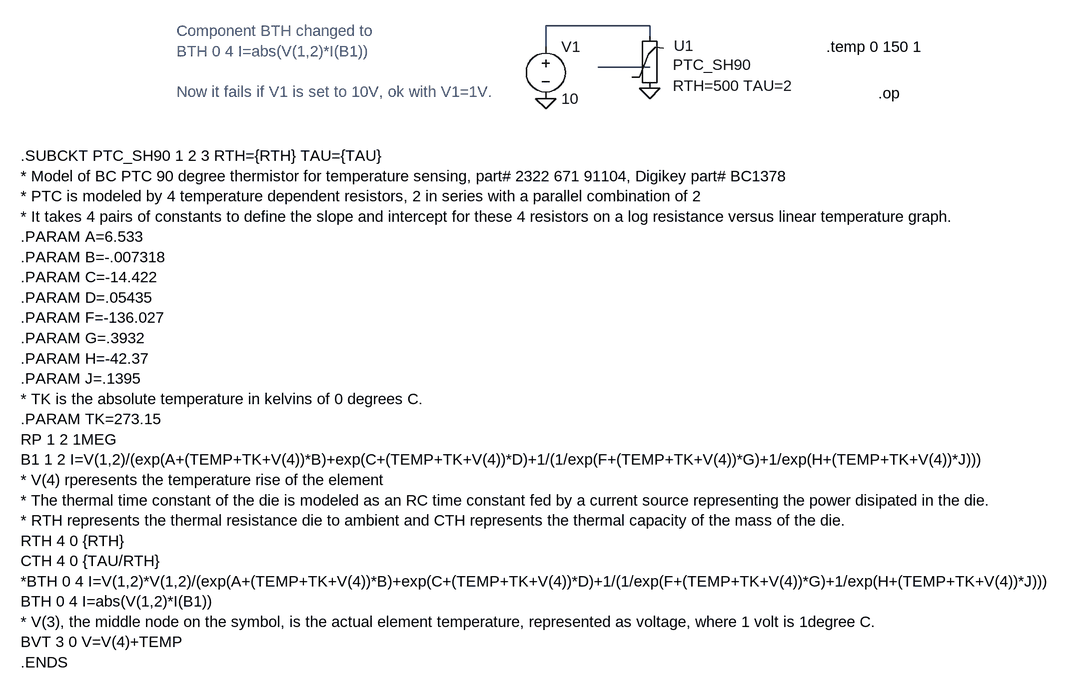
[diagram p0: schematic ptc90_2.asc]
ptc90_2.asc, the LTspice schematic file:
Version 4
SHEET 1 1628 964
WIRE 624 80 624 48
WIRE 784 48 624 48
WIRE 784 64 784 48
WIRE 784 112 704 112
FLAG 784 144 0
FLAG 624 160 0
SYMBOL voltage 624 64 R0
WINDOW 123 0 0 Left 0
WINDOW 39 0 0 Left 0
SYMATTR InstName V1
SYMATTR Value 10
SYMBOL PTC_resistor 768 48 R0
SYMATTR InstName U1
SYMATTR SpiceModel PTC_SH90
TEXT -184 248 Left 0 !.SUBCKT PTC_SH90 1 2 3 RTH={RTH} TAU={TAU}\n* Model of BC PTC 90 degree thermistor for temperature sensing, part# 2322 671 91104, Digikey part# BC1378\n* PTC is modeled by 4 temperature dependent resistors, 2 in series with a parallel combination of 2\n* It takes 4 pairs of constants to define the slope and intercept for these 4 resistors on a log resistance versus linear temperature graph.\n.PARAM A=6.533\n.PARAM B=-.007318\n.PARAM C=-14.422\n.PARAM D=.05435\n.PARAM F=-136.027\n.PARAM G=.3932\n.PARAM H=-42.37\n.PARAM J=.1395\n* TK is the absolute temperature in kelvins of 0 degrees C.\n.PARAM TK=273.15\nRP 1 2 1MEG\nB1 1 2 I=V(1,2)/(exp(A+(TEMP+TK+V(4))*B)+exp(C+(TEMP+TK+V(4))*D)+1/(1/exp(F+(TEMP+TK+V(4))*G)+1/exp(H+(TEMP+TK+V(4))*J)))\n* V(4) rperesents the temperature rise of the element\n* The thermal time constant of the die is modeled as an RC time constant fed by a current source representing the power disipated in the die.\n* RTH represents the thermal resistance die to ambient and CTH represents the thermal capacity of the mass of the die.\nRTH 4 0 {RTH}\nCTH 4 0 {TAU/RTH}\n*BTH 0 4 I=V(1,2)*V(1,2)/(exp(A+(TEMP+TK+V(4))*B)+exp(C+(TEMP+TK+V(4))*D)+1/(1/exp(F+(TEMP+TK+V(4))*G)+1/exp(H+(TEMP+TK+V(4))*J)))\nBTH 0 4 I=abs(V(1,2)*I(B1))\n* V(3), the middle node on the symbol, is the actual element temperature, represented as voltage, where 1 volt is 1degree C.\nBVT 3 0 V=V(4)+TEMP\n.ENDS
TEXT 1136 152 Left 0 !.op
TEXT 1056 80 Left 0 !.temp 0 150 1
TEXT 56 56 Left 0 ;Component BTH changed to \nBTH 0 4 I=abs(V(1,2)*I(B1))\n \nNow it fails if V1 is set to 10V, ok with V1=1V.

The netlist it stands for:
* ptc90_2.asc
V1 N001 0 10
XU1 N001 0 N002 PTC_SH90 RTH=500 TAU=2  ; pins A B A1
.SUBCKT PTC_SH90 1 2 3 RTH={RTH} TAU={TAU}
* Model of BC PTC 90 degree thermistor for temperature sensing, part# 2322 671 91104, Digikey part# BC1378
* PTC is modeled by 4 temperature dependent resistors, 2 in series with a parallel combination of 2
* It takes 4 pairs of constants to define the slope and intercept for these 4 resistors on a log resistance versus linear temperature graph.
.PARAM A=6.533
.PARAM B=-.007318
.PARAM C=-14.422
.PARAM D=.05435
.PARAM F=-136.027
.PARAM G=.3932
.PARAM H=-42.37
.PARAM J=.1395
* TK is the absolute temperature in kelvins of 0 degrees C.
.PARAM TK=273.15
RP 1 2 1MEG
B1 1 2 I=V(1,2)/(exp(A+(TEMP+TK+V(4))*B)+exp(C+(TEMP+TK+V(4))*D)+1/(1/exp(F+(TEMP+TK+V(4))*G)+1/exp(H+(TEMP+TK+V(4))*J)))
* V(4) rperesents the temperature rise of the element
* The thermal time constant of the die is modeled as an RC time constant fed by a current source representing the power disipated in the die.
* RTH represents the thermal resistance die to ambient and CTH represents the thermal capacity of the mass of the die.
RTH 4 0 {RTH}
CTH 4 0 {TAU/RTH}
*BTH 0 4 I=V(1,2)*V(1,2)/(exp(A+(TEMP+TK+V(4))*B)+exp(C+(TEMP+TK+V(4))*D)+1/(1/exp(F+(TEMP+TK+V(4))*G)+1/exp(H+(TEMP+TK+V(4))*J)))
BTH 0 4 I=abs(V(1,2)*I(B1))
* V(3), the middle node on the symbol, is the actual element temperature, represented as voltage, where 1 volt is 1degree C.
BVT 3 0 V=V(4)+TEMP
.ENDS
.op
.temp 0 150 1
* Component BTH changed to
* BTH 0 4 I=abs(V(1,2)*I(B1))
* Now it fails if V1 is set to 10V, ok with V1=1V.
.backanno
.end